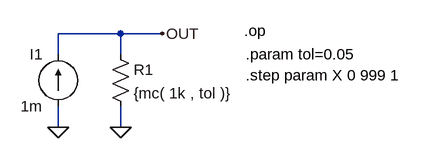
[diagram p0: schematic R_mc.asc]
R_mc.asc, the LTspice schematic file:
Version 4
SHEET 1 880 680
WIRE 144 64 48 64
WIRE 208 64 144 64
WIRE 48 96 48 64
WIRE 144 96 144 64
WIRE 48 208 48 176
WIRE 144 208 144 176
FLAG 48 208 0
FLAG 144 208 0
FLAG 208 64 OUT
SYMBOL res 128 80 R0
SYMATTR InstName R1
SYMATTR Value {mc( 1k , tol )}
SYMBOL current 48 176 R180
WINDOW 0 24 80 Left 2
WINDOW 3 24 0 Left 2
WINDOW 123 0 0 Left 0
WINDOW 39 0 0 Left 0
SYMATTR InstName I1
SYMATTR Value 1m
TEXT 336 96 Left 2 !.param tol=0.05
TEXT 336 128 Left 2 !.step param X 0 999 1
TEXT 334 60 Left 2 !.op

The netlist it stands for:
* R_mc.asc
R1 OUT 0 {mc( 1k , tol )}
I1 0 OUT 1m
.param tol=0.05
.step param X 0 999 1
.op
.backanno
.end